# Altium schematic sheet fonte.SchDoc
size A4
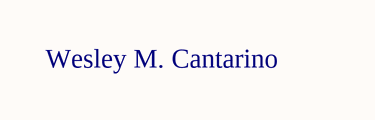
[diagram p0: fonte.SchDoc]

## Notes on the sheet
- Wesley M. Cantarino